# EAGLE design duende3 (EAGLE 7.3.0)
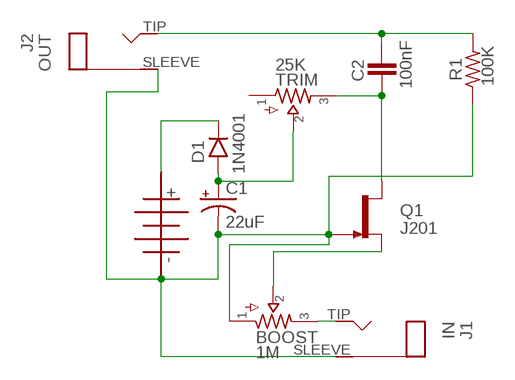
[diagram p0: schematic, sheet 1]

## Parts
+9V  +9V  BATTERY  [BATTERY]
BOOST  1M  POTSLARGE_PADS  [PADS_LARGE]
C1  22uF  0501  [050_020_1]
C2  100nF  CER/FILMBOX.1  [BOX_SMALL]
D1  1N4001  DO41.3  [DO41-3]
J1  IN  MONOPADS  [TWO_PADS]
J2  OUT  MONOPADS  [TWO_PADS]
Q1  J201  [TO92-]
R1  100K  R_.3B  [R0207/3]
TRIM  25K  POTSTRIM  [2262_TRIM]

## Nets
GND: +9V.P$2 BOOST.1 C1.- J1.SLEEVE J2.SLEEVE Q1.1(G) R1.1
N$1: +9V.P$1 D1.C
N$2: C1.+ D1.A TRIM.2
N$4: BOOST.2 Q1.2(S)
N$5: C2.2 Q1.3(D) TRIM.3
N$6: C2.1 J2.TIP R1.2
N$7: BOOST.3 J1.TIP
Unconnected: TRIM.1

## Library data of the parts
+9V = jacks:BATTERY
BOOST TRIM = potentiometers:POTS
C1 = capacitors-elec:050: 0.22 - 100uF Xicon values at Mouser.com: 10V: 10 - 100uF; 16V: 2.2 - 47uF; 25V: 0.47 - 47uF; 50V: 0.22 - 22uF
C2 = capacitors-film:CER/FILM: 47 - 120pF Xicon Ceramic Disc 2.5mm lead spacing
D1 = diodes:DO41: DO-41 Package Diodes: 1N4001 - 1N40019 Zener Diodes: 1N4728 - 1N4764
J1 J2 = jacks:MONO: Mono 1/4" Phone Jack
Q1 = transistors:J201: N-channel JFET
R1 = resistors:R_

## Net classes
0 default: width 0.635 mm, clearance 0.635 mm

## Board
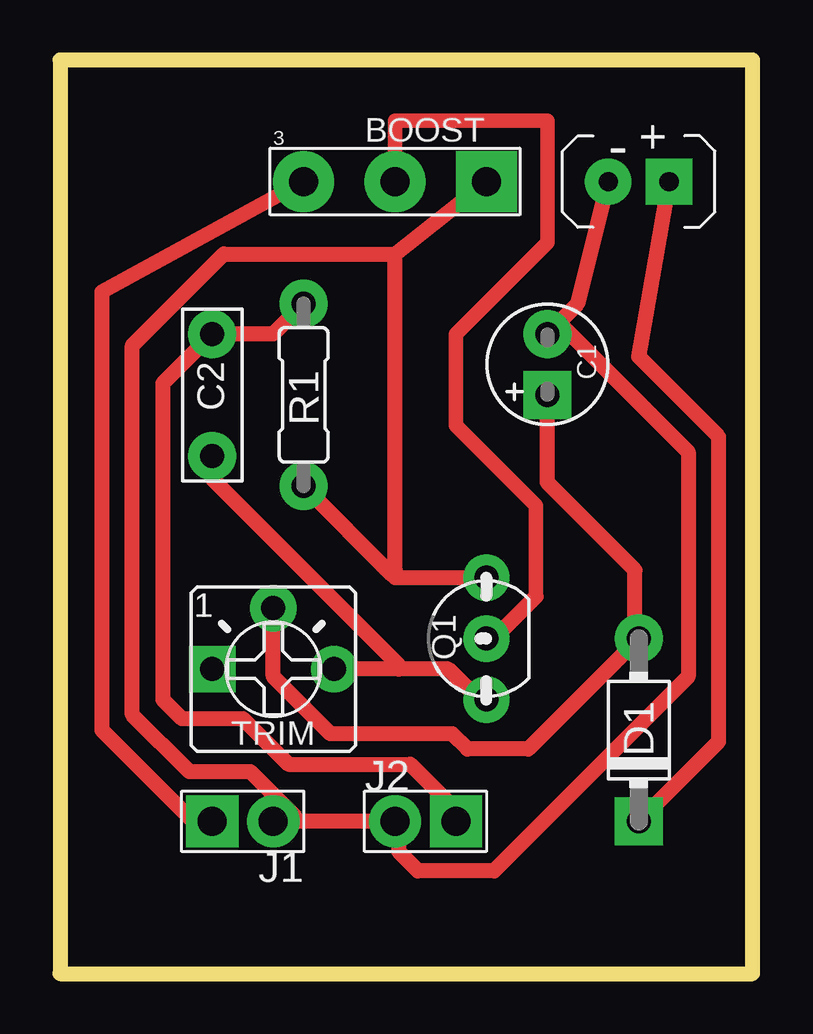
[diagram p1: board, top side]

Size 28.88 x 38.09 mm. Coordinates in mm from the lower left corner, seen from the top.
Outline: 0,0 28.88,0 28.88,38.09 0,38.09 0,0
Copper layers (1*16): Top 0.035mm / dielectric 1.5mm / Bottom 0.035mm
Design rules "default": minimum track width 10mil, minimum drill 24mil, track to track 8mil, track to pad 8mil, pad to pad 8mil, via to via 8mil, smd to smd 8mil, copper to edge 40mil, drill to drill 8mil, minimum pad ring 10mil, minimum via ring 8mil, stop-mask expansion 4mil, vias tented up to drill 0mil, thermal gap 10mil

### Footprints (pad centres in the part's own frame; a part is rotated, then mirrored left to right if it is on the bottom)
BATTERY = drill 0.8 pad 1.93 square: P$1 -1.27,0 | drill 0.8 pad 1.93: P$2 1.27,0
PADS_LARGE = drill 1.2 pad 2.54 square: 1 3.81,0 | drill 1.2 pad 2.54: 2 0,0; 3 -3.81,0
050_020_1 = drill 1 pad 2 square: + -1.27,0 | drill 1 pad 2: - 1.27,0
BOX_SMALL = drill 1 pad 2: 1 -2.54,0; 2 2.54,0
DO41-3 = drill 1 pad 2: A 3.81,0 | drill 1 pad 2 square: C -3.81,0
TWO_PADS = drill 1.2 pad 2.184: SLEEVE -1.27,0 | drill 1.2 pad 2.184 square: TIP 1.27,0
TO92- = drill 1 pad 1.93: 1 2.54,0; 2 0,0; 3 -2.54,0
R0207/3 = drill 1 pad 2: 1 -3.81,0; 2 3.81,0
2262_TRIM = drill 1 pad 1.93 square: 1 -2.54,0 | drill 1 pad 1.93: 2 0,2.54; 3 2.54,0

### Placement (x,y rotation side)
+9V  24.13,33.02 180 top
BOOST  13.97,33.02 0 top
C1  20.32,25.4 90 top
C2  6.35,24.13 270 top
D1  24.13,10.16 90 top
J1  7.62,6.35 180 top
J2  15.24,6.35 0 top
Q1  17.78,13.97 90 top
R1  10.16,24.13 90 top
TRIM  8.89,12.7 0 top

### Tracks (layer width: path | path; a pad name or v marks a point on that pad's centre or on a via)
GND
  Top 0.635: Q1.1 13.97,16.51 13.81,16.67 | R1.1 13.81,16.67 | 13.97,30 13.97,16.83 13.81,16.67 | 13.97,30 BOOST.1 | +9V.P$2 21.59,27.94 C1.- 20.95,26.99 26.19,21.75 26.19,12.38 18.1,4.29 14.92,4.29 14.13,5.08 14.13,6.19 J2.SLEEVE J1.SLEEVE 9.84,6.51 7.94,8.41 5.4,8.41 3.02,10.79 3.02,26.19 6.83,30 13.97,30
N$1
  Top 0.635: +9V.P$1 24.13,25.72 27.46,22.38 27.46,9.68 D1.C
N$2
  Top 0.635: TRIM.2 8.89,12.38 11.27,10 16.35,10 16.99,9.37 19.53,9.37 D1.A 23.97,14.13 23.97,16.83 20.32,20.48 C1.+
N$4
  Top 0.61: 19.84,15.72 19.84,19.53 16.51,22.86 16.51,26.67 20.32,30.48 20.32,35.56 13.97,35.56 BOOST.2
  Top 0.635: Q1.2 18.1,13.97 19.84,15.72
N$5
  Top 0.635: 14.13,12.7 16.19,12.7 17.46,11.43 Q1.3 | 14.13,12.7 TRIM.3 | C2.2 6.35,20.64 14.13,12.86 14.13,12.7
N$6
  Top 0.635: R1.2 8.89,26.67 C2.1 4.29,24.61 4.29,11.43 5.08,10.64 7.62,10.64 9.53,8.73 14.6,8.73 16.51,6.83 J2.TIP
N$7
  Top 0.635: J1.TIP 5.56,6.35 1.75,10.16 1.75,28.42 BOOST.3